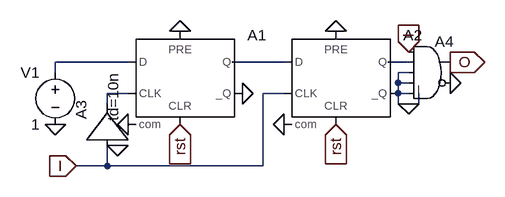
[diagram p0: schematic ignore_first_pulse.asc]
ignore_first_pulse.asc, the LTspice schematic file:
Version 4
SHEET 1 880 680
WIRE 32 192 -80 192
WIRE 272 192 192 192
WIRE 464 192 432 192
WIRE -80 208 -80 192
WIRE 464 208 448 208
WIRE 448 224 448 208
WIRE 464 224 448 224
WIRE 32 240 0 240
WIRE 272 240 240 240
WIRE 448 240 448 224
WIRE 464 240 448 240
WIRE 0 256 0 240
WIRE 448 256 448 240
WIRE 464 256 448 256
WIRE 480 256 480 240
WIRE 480 256 464 256
WIRE 0 352 0 320
WIRE 0 352 -48 352
WIRE 240 352 240 240
WIRE 240 352 0 352
FLAG 112 144 0
FLAG 32 288 0
FLAG -48 352 I
IOPIN -48 352 In
FLAG -80 288 0
FLAG 112 288 rst
IOPIN 112 288 In
FLAG 352 144 0
FLAG 272 288 0
FLAG 352 288 rst
IOPIN 352 288 In
FLAG 16 320 0
FLAG 208 240 0
FLAG 464 256 0
FLAG 528 224 0
FLAG 464 176 I
IOPIN 464 176 In
FLAG 528 192 O
IOPIN 528 192 Out
SYMBOL Digital\\dflop 112 144 R0
SYMATTR InstName A1
SYMBOL voltage -80 192 M0
SYMATTR InstName V1
SYMATTR Value 1
SYMBOL Digital\\dflop 352 144 R0
SYMATTR InstName A2
SYMBOL Digital\\buf1 -64 320 R270
WINDOW 3 37 73 Left 0
SYMATTR InstName A3
SYMATTR Value td=10n
SYMBOL Digital\\and 496 144 R0
SYMATTR InstName A4

The netlist it stands for:
* ignore_first_pulse.asc
A1 N001 0 N004 0 rst 0 N002 0 DFLOP
V1 N001 0 1
A2 N002 0 I 0 rst 0 N003 0 DFLOP
A3 I 0 0 0 0 0 N004 0 BUF td=10n
A4 I N003 0 0 0 0 O 0 AND
.backanno
.end